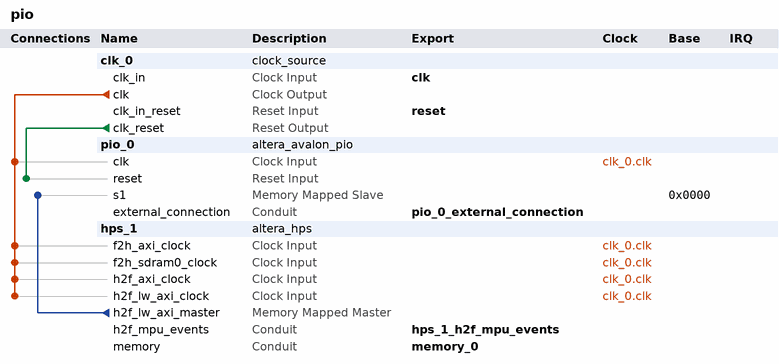
[diagram p0: system contents]
# Platform Designer (Qsys) system pio, Cyclone V 5CSXFC6D6F31C6
# Parameters at their usual value, and those the tool derives, are not listed.
package require -exact qsys 25.1
create_system pio
set_project_property DEVICE_FAMILY {Cyclone V}
set_project_property DEVICE 5CSXFC6D6F31C6

add_instance clk_0 clock_source 25.1
set_instance_parameter_value clk_0 clockFrequency 50000000

add_instance pio_0 altera_avalon_pio 25.1
set_instance_parameter_value pio_0 direction Input
set_instance_parameter_value pio_0 width 4

add_instance hps_1 altera_hps 25.1
set_instance_parameter_value hps_1 EMAC1_Mode N/A
set_instance_parameter_value hps_1 EMAC1_PinMuxing Unused
set_instance_parameter_value hps_1 F2SCLK_COLDRST_Enable false
set_instance_parameter_value hps_1 F2SCLK_DBGRST_Enable false
set_instance_parameter_value hps_1 F2SCLK_WARMRST_Enable false
set_instance_parameter_value hps_1 F2SDRAM_Type AXI-3
set_instance_parameter_value hps_1 F2SDRAM_Width 64
set_instance_parameter_value hps_1 F2SINTERRUPT_Enable false
set_instance_parameter_value hps_1 F2S_Width 2
set_instance_parameter_value hps_1 FPGA_PERIPHERAL_OUTPUT_CLOCK_FREQ_EMAC0_GTX_CLK 125
set_instance_parameter_value hps_1 FPGA_PERIPHERAL_OUTPUT_CLOCK_FREQ_EMAC0_MD_CLK 2.5
set_instance_parameter_value hps_1 FPGA_PERIPHERAL_OUTPUT_CLOCK_FREQ_EMAC1_GTX_CLK 125
set_instance_parameter_value hps_1 FPGA_PERIPHERAL_OUTPUT_CLOCK_FREQ_EMAC1_MD_CLK 2.5
set_instance_parameter_value hps_1 HPS_PROTOCOL DDR3
set_instance_parameter_value hps_1 I2C0_Mode N/A
set_instance_parameter_value hps_1 I2C0_PinMuxing Unused
set_instance_parameter_value hps_1 I2C1_Mode N/A
set_instance_parameter_value hps_1 I2C1_PinMuxing Unused
set_instance_parameter_value hps_1 LWH2F_Enable true
set_instance_parameter_value hps_1 MEM_BANKADDR_WIDTH 3
set_instance_parameter_value hps_1 MEM_CLK_FREQ 300.0
set_instance_parameter_value hps_1 MEM_CLK_FREQ_MAX 400.0
set_instance_parameter_value hps_1 MEM_COL_ADDR_WIDTH 8
set_instance_parameter_value hps_1 MEM_DQ_WIDTH 8
set_instance_parameter_value hps_1 MEM_DRV_STR RZQ/6
set_instance_parameter_value hps_1 MEM_ROW_ADDR_WIDTH 12
set_instance_parameter_value hps_1 MEM_RTT_NOM {ODT Disabled}
set_instance_parameter_value hps_1 MEM_RTT_WR {Dynamic ODT off}
set_instance_parameter_value hps_1 MEM_TCL 7
set_instance_parameter_value hps_1 MEM_TFAW_NS 37.5
set_instance_parameter_value hps_1 MEM_TINIT_US 499
set_instance_parameter_value hps_1 MEM_TMRD_CK 3
set_instance_parameter_value hps_1 MEM_TRAS_NS 40.0
set_instance_parameter_value hps_1 MEM_TRCD_NS 15.0
set_instance_parameter_value hps_1 MEM_TREFI_US 7.0
set_instance_parameter_value hps_1 MEM_TRFC_NS 75.0
set_instance_parameter_value hps_1 MEM_TRP_NS 15.0
set_instance_parameter_value hps_1 MEM_TWTR 2
set_instance_parameter_value hps_1 MEM_VENDOR JEDEC
set_instance_parameter_value hps_1 MEM_WTCL 6
set_instance_parameter_value hps_1 MPU_EVENTS_Enable true
set_instance_parameter_value hps_1 QSPI_Mode N/A
set_instance_parameter_value hps_1 QSPI_PinMuxing Unused
set_instance_parameter_value hps_1 REF_CLK_FREQ 125.0
set_instance_parameter_value hps_1 S2FCLK_USER2CLK 5
set_instance_parameter_value hps_1 S2F_Width 2
set_instance_parameter_value hps_1 SDIO_Mode N/A
set_instance_parameter_value hps_1 SDIO_PinMuxing Unused
set_instance_parameter_value hps_1 SPIM1_Mode N/A
set_instance_parameter_value hps_1 SPIM1_PinMuxing Unused
set_instance_parameter_value hps_1 STM_Enable false
set_instance_parameter_value hps_1 TIMING_BOARD_AC_SKEW 0.02
set_instance_parameter_value hps_1 TIMING_BOARD_AC_TO_CK_SKEW 0.0
set_instance_parameter_value hps_1 TIMING_BOARD_DQ_TO_DQS_SKEW 0.0
set_instance_parameter_value hps_1 TIMING_BOARD_MAX_CK_DELAY 0.6
set_instance_parameter_value hps_1 TIMING_BOARD_MAX_DQS_DELAY 0.6
set_instance_parameter_value hps_1 TIMING_BOARD_SKEW_BETWEEN_DQS 0.02
set_instance_parameter_value hps_1 TIMING_BOARD_SKEW_CKDQS_DIMM_MAX 0.01
set_instance_parameter_value hps_1 TIMING_BOARD_SKEW_CKDQS_DIMM_MIN -0.01
set_instance_parameter_value hps_1 TIMING_BOARD_SKEW_WITHIN_DQS 0.02
set_instance_parameter_value hps_1 TIMING_TDH 125
set_instance_parameter_value hps_1 TIMING_TDQSCK 400
set_instance_parameter_value hps_1 TIMING_TDQSQ 120
set_instance_parameter_value hps_1 TIMING_TDS 50
set_instance_parameter_value hps_1 TIMING_TIH 250
set_instance_parameter_value hps_1 TIMING_TIS 175
set_instance_parameter_value hps_1 TIMING_TQSH 0.38
set_instance_parameter_value hps_1 UART0_Mode N/A
set_instance_parameter_value hps_1 UART0_PinMuxing Unused
set_instance_parameter_value hps_1 USB1_Mode N/A
set_instance_parameter_value hps_1 USB1_PinMuxing Unused
set_instance_parameter_value hps_1 desired_cfg_clk_mhz 100.0
set_instance_parameter_value hps_1 desired_qspi_clk_mhz 400.0

# connections
add_connection clk_0.clk hps_1.f2h_axi_clock clock
add_connection clk_0.clk hps_1.f2h_sdram0_clock clock
add_connection clk_0.clk hps_1.h2f_axi_clock clock
add_connection clk_0.clk hps_1.h2f_lw_axi_clock clock
add_connection clk_0.clk pio_0.clk clock
add_connection clk_0.clk_reset pio_0.reset reset
add_connection hps_1.h2f_lw_axi_master pio_0.s1 avalon
set_connection_parameter_value hps_1.h2f_lw_axi_master/pio_0.s1 baseAddress 0x0000

# exported interfaces
add_interface clk clock sink
set_interface_property clk EXPORT_OF clk_0.clk_in
add_interface hps_1_h2f_mpu_events conduit end
set_interface_property hps_1_h2f_mpu_events EXPORT_OF hps_1.h2f_mpu_events
add_interface memory_0 conduit end
set_interface_property memory_0 EXPORT_OF hps_1.memory
add_interface pio_0_external_connection conduit end
set_interface_property pio_0_external_connection EXPORT_OF pio_0.external_connection
add_interface reset reset sink
set_interface_property reset EXPORT_OF clk_0.clk_in_reset

set_interconnect_requirement {$system} qsys_mm.clockCrossingAdapter HANDSHAKE
set_interconnect_requirement {$system} qsys_mm.enableEccProtection FALSE
set_interconnect_requirement {$system} qsys_mm.insertDefaultSlave FALSE
set_interconnect_requirement {$system} qsys_mm.maxAdditionalLatency 1

save_system pio.qsys
